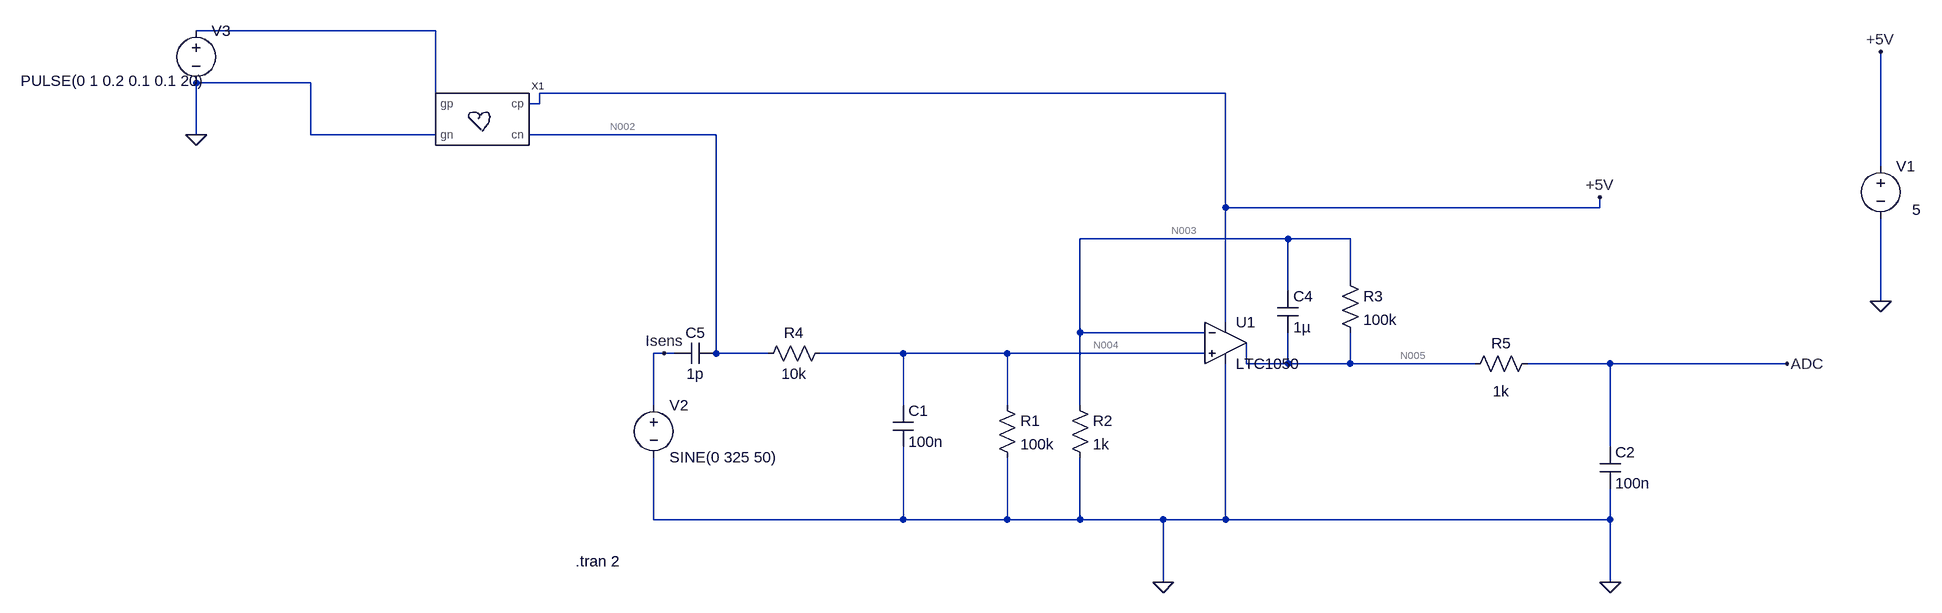
[diagram p0: schematic Draft1.asc]
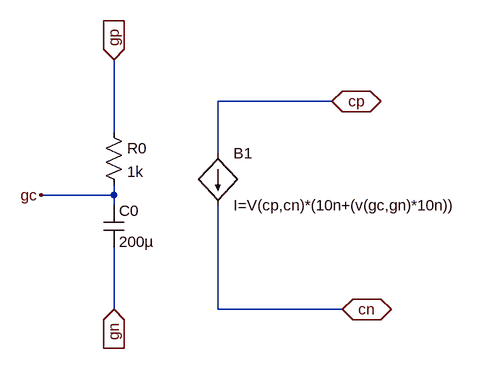
[diagram p1: sub-circuit capteurgraphene.asc]
Draft1.asc, the LTspice schematic file:
Version 4
SHEET 1 1556 680
WIRE -736 -448 -1104 -448
WIRE -928 -368 -1104 -368
WIRE 480 -352 -576 -352
WIRE -736 -336 -736 -448
WIRE -576 -336 -576 -352
WIRE -576 -336 -592 -336
WIRE -1104 -288 -1104 -368
WIRE -928 -288 -928 -368
WIRE -736 -288 -928 -288
WIRE -304 -288 -592 -288
WIRE 1488 -240 1488 -416
WIRE 480 -176 480 -352
WIRE 1056 -176 1056 -192
WIRE 1056 -176 480 -176
WIRE 576 -128 256 -128
WIRE 672 -128 576 -128
WIRE 672 -64 672 -128
WIRE 576 -48 576 -128
WIRE 1488 -32 1488 -160
WIRE 480 0 480 -176
WIRE 256 16 256 -128
WIRE 448 16 256 16
WIRE -384 48 -400 48
WIRE -368 48 -384 48
WIRE -304 48 -304 -288
WIRE -304 48 -320 48
WIRE -224 48 -304 48
WIRE -16 48 -144 48
WIRE 144 48 -16 48
WIRE 448 48 144 48
WIRE 512 64 512 32
WIRE 576 64 576 16
WIRE 576 64 512 64
WIRE 672 64 672 16
WIRE 672 64 576 64
WIRE 864 64 672 64
WIRE 1072 64 944 64
WIRE 1344 64 1072 64
WIRE -400 128 -400 48
WIRE -16 128 -16 48
WIRE 144 128 144 48
WIRE 256 128 256 16
WIRE 1072 192 1072 64
WIRE -400 304 -400 208
WIRE -16 304 -16 192
WIRE -16 304 -400 304
WIRE 144 304 144 208
WIRE 144 304 -16 304
WIRE 256 304 256 208
WIRE 256 304 144 304
WIRE 384 304 256 304
WIRE 480 304 480 64
WIRE 480 304 384 304
WIRE 1072 304 1072 256
WIRE 1072 304 480 304
WIRE 384 400 384 304
WIRE 1072 400 1072 304
FLAG 384 400 0
FLAG 1072 400 0
FLAG 1344 64 ADC
FLAG -384 48 Isens
FLAG 1056 -192 +5V
FLAG 1488 -32 0
FLAG 1488 -416 +5V
FLAG -1104 -288 0
SYMBOL res 128 112 R0
SYMATTR InstName R1
SYMATTR Value 100k
SYMBOL res 240 112 R0
SYMATTR InstName R2
SYMATTR Value 1k
SYMBOL res 656 -80 R0
SYMATTR InstName R3
SYMATTR Value 100k
SYMBOL res -128 32 R90
WINDOW 0 0 56 VBottom 2
WINDOW 3 32 56 VTop 2
SYMATTR InstName R4
SYMATTR Value 10k
SYMBOL res 960 48 R90
WINDOW 0 0 56 VBottom 2
WINDOW 3 43 56 VTop 2
SYMATTR InstName R5
SYMATTR Value 1k
SYMBOL cap -32 128 R0
SYMATTR InstName C1
SYMATTR Value 100n
SYMBOL cap 1056 192 R0
SYMATTR InstName C2
SYMATTR Value 100n
SYMBOL cap 560 -48 R0
SYMATTR InstName C4
SYMATTR Value 1µ
SYMBOL Opamps\\LTC1050 480 -32 R0
SYMATTR InstName U1
SYMBOL voltage 1488 -256 R0
WINDOW 3 49 83 Left 2
SYMATTR Value 5
SYMATTR InstName V1
SYMBOL CapteurGraphene -720 -336 R0
SYMATTR InstName X1
SYMBOL cap -304 32 R90
WINDOW 0 0 32 VBottom 2
WINDOW 3 32 32 VTop 2
SYMATTR InstName C5
SYMATTR Value 1p
SYMBOL voltage -400 112 R0
WINDOW 123 0 0 Left 2
WINDOW 39 0 0 Left 2
SYMATTR InstName V2
SYMATTR Value SINE(0 325 50)
SYMBOL voltage -1104 -464 R0
WINDOW 3 -270 93 Left 2
WINDOW 123 0 0 Left 2
WINDOW 39 0 0 Left 2
SYMATTR Value PULSE(0 1 0.2 0.1 0.1 20)
SYMATTR InstName V3
TEXT -520 368 Left 2 !.tran 2

capteurgraphene.asc, the sub-circuit schematic file:
Version 4
SHEET 1 880 680
WIRE 528 32 352 32
WIRE 192 80 192 -32
WIRE 352 112 352 32
WIRE 192 176 192 160
WIRE 192 176 80 176
WIRE 192 192 192 176
WIRE 192 352 192 256
WIRE 352 352 352 192
WIRE 544 352 352 352
FLAG 192 -32 gp
IOPIN 192 -32 In
FLAG 192 352 gn
IOPIN 192 352 In
FLAG 528 32 cp
IOPIN 528 32 BiDir
FLAG 544 352 cn
IOPIN 544 352 BiDir
FLAG 80 176 gc
SYMBOL res 176 64 R0
SYMATTR InstName R0
SYMATTR Value 1k
SYMBOL cap 176 192 R0
SYMATTR InstName C0
SYMATTR Value 200µ
SYMBOL bi 352 112 R0
SYMATTR InstName B1
SYMATTR Value I=V(cp,cn)*(10n+(v(gc,gn)*10n))

The netlist it stands for:
* Draft1.asc
R1 N004 0 100k
R2 N003 0 1k
R3 N003 N005 100k
R4 N004 N002 10k
R5 ADC N005 1k
C1 N004 0 100n
C2 ADC 0 100n
C4 N003 N005 1µ
XU1 N004 N003 +5V 0 N005 LTC1050  ; pins In+ In- V+ V- OUT
V1 +5V 0 5
XX1 N001 0 +5V N002 capteurgraphene
C5 N002 Isens 1p
V2 Isens 0 SINE(0 325 50)
V3 N001 0 PULSE(0 1 0.2 0.1 0.1 20)

* block symbol definitions
.subckt capteurgraphene gp gn cp cn
R0 gp gc 1k
C0 gc gn 200µ
B1 cp cn I=V(cp,cn)*(10n+(v(gc,gn)*10n))
.ends capteurgraphene

.tran 2
.lib LTC.lib
.backanno
.end

* Results of the author's LTspice run, read from the files saved beside the schematic
* Operating Point, zero values left out:
*   V(n004) = 4.995 mV
*   V(n003) = 4.995 mV
*   V(n005) = 504.4 mV
*   V(n002) = 5.494 mV
*   V(adc) = 504.4 mV
*   V(+5v) = 5 V
*   I(R4) = -49.95 nA
*   I(R3) = -4.995 µA
*   I(R2) = 4.995 µA
*   I(R1) = 49.95 nA
*   I(V1) = -754.2 µA
*   Ix(u1:3) = 754.1 µA
*   Ix(u1:4) = -749.1 µA
*   Ix(u1:5) = -4.995 µA
*   Ix(x1:CP) = 49.95 nA
*   Ix(x1:CN) = -49.95 nA
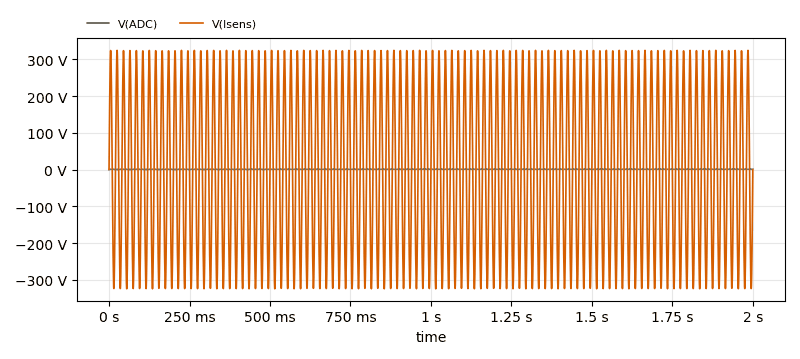
[diagram p2: Transient Analysis of Draft1.asc, plotted from the saved traces]
* Transient Analysis, 1 run:
*   V(ADC): min 493.8 mV, max 1.018 V, average 867.1 mV, rms 887.7 mV, last 999.1 mV
*   V(Isens): min -324.1 V, max 324.1 V, average 1.487 mV, rms 226.9 V, last 0 V